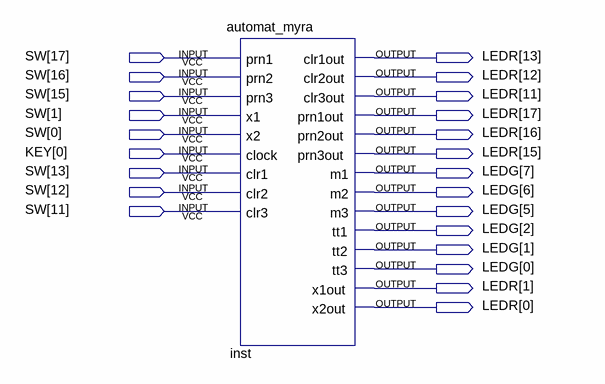
[diagram p0: schematic sheet]
// Quartus schematic test1.bdf as structural Verilog: 1 symbols, 23 pins
module test1 (
  input  [17:0] SW,
  input  [0:0] KEY,
  output [17:0] LEDR,
  output [7:0] LEDG
);

  automat_myra inst (
    .prn1(SW[17]), .prn2(SW[16]), .prn3(SW[15]), .x1(SW[1]), .x2(SW[0]), .clock(KEY[0]), .clr1(SW[13]),
    .clr2(SW[12]), .clr3(SW[11]), .clr1out(LEDR[13]), .clr2out(LEDR[12]), .clr3out(LEDR[11]),
    .prn1out(LEDR[17]), .prn2out(LEDR[16]), .prn3out(LEDR[15]), .m1(LEDG[7]), .m2(LEDG[6]), .m3(LEDG[5]),
    .tt1(LEDG[2]), .tt2(LEDG[1]), .tt3(LEDG[0]), .x1out(LEDR[1]), .x2out(LEDR[0]));
endmodule
